# Altium schematic sheet 11_PHY_FE_17-24.SchDoc
size 419 x 296 mm; Author: Serbinov O.A.; CompanyName: ELSICOM; DrawnBy: Serbinov O.A.; Engineer: Serbinov O.A.; Organization: Elsicom; Address1: Kirova avenue, 58; Address2: Tomsk; Address3: Russia 634012; DocumentNumber: 12; SheetNumber: 12; SheetTotal: 44; ProjectName: 48_PORTS
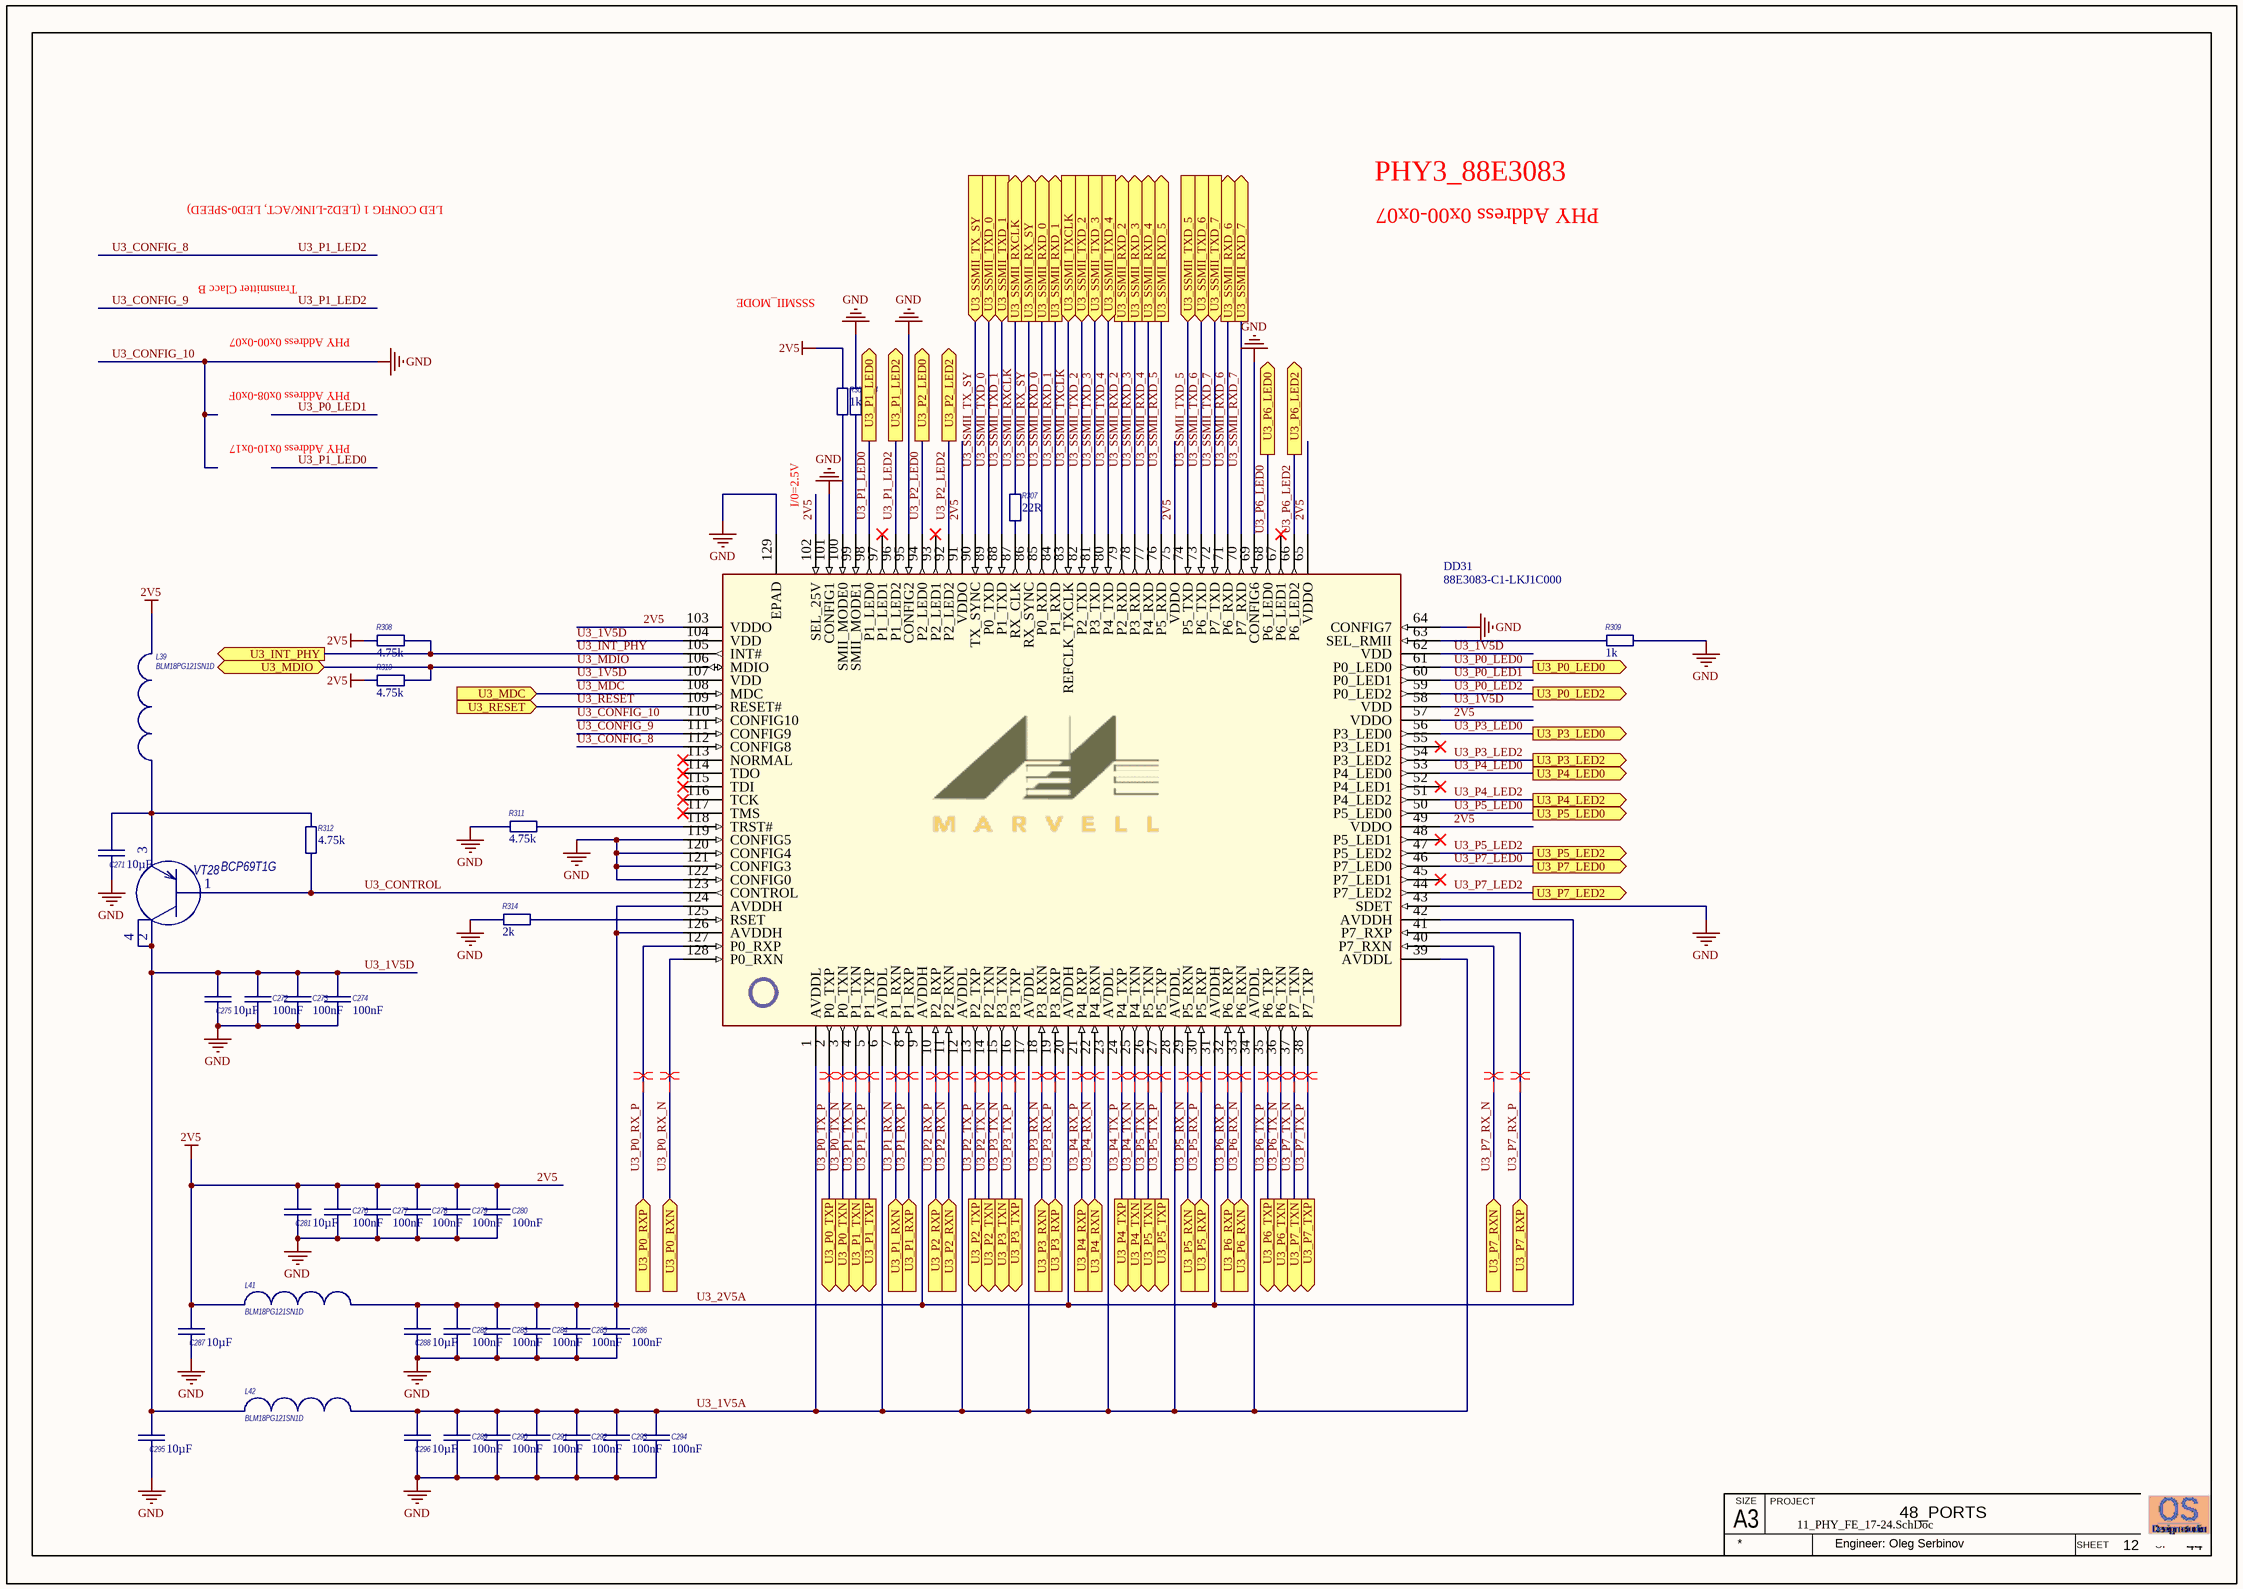
[diagram p0: 11_PHY_FE_17-24.SchDoc]

## Parts
C271  Capacitance: 10µF  [CAPC2012[0805]]  (hidden comment: GRM21BR61C106KE15)
C272  Capacitance: 100nF  [C0402_IPC High Density]  (hidden comment: GRM155R71E104KE14D)
C273  Capacitance: 100nF  [C0402_IPC High Density]  (hidden comment: GRM155R71E104KE14D)
C274  Capacitance: 100nF  [C0402_IPC High Density]  (hidden comment: GRM155R71E104KE14D)
C275  Capacitance: 10µF  [CAPC2012[0805]]  (hidden comment: GRM21BR61C106KE15)
C276  Capacitance: 100nF  [C0402_IPC High Density]  (hidden comment: GRM155R71E104KE14D)
C277  Capacitance: 100nF  [C0402_IPC High Density]  (hidden comment: GRM155R71E104KE14D)
C278  Capacitance: 100nF  [C0402_IPC High Density]  (hidden comment: GRM155R71E104KE14D)
C279  Capacitance: 100nF  [C0402_IPC High Density]  (hidden comment: GRM155R71E104KE14D)
C280  Capacitance: 100nF  [C0402_IPC High Density]  (hidden comment: GRM155R71E104KE14D)
C281  Capacitance: 10µF  [CAPC2012[0805]]  (hidden comment: GRM21BR61C106KE15)
C282  Capacitance: 100nF  [C0402_IPC High Density]  (hidden comment: GRM155R71E104KE14D)
C283  Capacitance: 100nF  [C0402_IPC High Density]  (hidden comment: GRM155R71E104KE14D)
C284  Capacitance: 100nF  [C0402_IPC High Density]  (hidden comment: GRM155R71E104KE14D)
C285  Capacitance: 100nF  [C0402_IPC High Density]  (hidden comment: GRM155R71E104KE14D)
C286  Capacitance: 100nF  [C0402_IPC High Density]  (hidden comment: GRM155R71E104KE14D)
C287  Capacitance: 10µF  [CAPC2012[0805]]  (hidden comment: GRM21BR61C106KE15)
C288  Capacitance: 10µF  [CAPC2012[0805]]  (hidden comment: GRM21BR61C106KE15)
C289  Capacitance: 100nF  [C0402_IPC High Density]  (hidden comment: GRM155R71E104KE14D)
C290  Capacitance: 100nF  [C0402_IPC High Density]  (hidden comment: GRM155R71E104KE14D)
C291  Capacitance: 100nF  [C0402_IPC High Density]  (hidden comment: GRM155R71E104KE14D)
C292  Capacitance: 100nF  [C0402_IPC High Density]  (hidden comment: GRM155R71E104KE14D)
C293  Capacitance: 100nF  [C0402_IPC High Density]  (hidden comment: GRM155R71E104KE14D)
C294  Capacitance: 100nF  [C0402_IPC High Density]  (hidden comment: GRM155R71E104KE14D)
C295  Capacitance: 10µF  [CAPC2012[0805]]  (hidden comment: GRM21BR61C106KE15)
C296  Capacitance: 10µF  [CAPC2012[0805]]  (hidden comment: GRM21BR61C106KE15)
DD31  88E3083-C1-LKJ1C000  [LQFP-128N]
L39  BLM18PG121SN1D  [INDC1608X95N]
L41  BLM18PG121SN1D  [INDC1608X95N]
L42  BLM18PG121SN1D  [INDC1608X95N]
R303  Resistance: 1k  [R0402_IPC High Density]  (hidden comment: ERJ-2RKF1001X)
R304  Resistance: 1k  [R0402_IPC High Density]  (hidden comment: ERJ-2RKF1001X)
R307  Resistance: 22R  [R0402_IPC High Density]  (hidden comment: ERJ-2RKF22R0X)
R308  Resistance (Ohms): 4.75k  [R0402_IPC High Density]  (hidden comment: ERJ-2RKF4751X)
R309  Resistance: 1k  [R0402_IPC High Density]  (hidden comment: ERJ-2RKF1001X)
R310  Resistance (Ohms): 4.75k  [R0402_IPC High Density]  (hidden comment: ERJ-2RKF4751X)
R311  Resistance (Ohms): 4.75k  [R0402_IPC High Density]  (hidden comment: ERJ-2RKF4751X)
R312  Resistance (Ohms): 4.75k  [R0402_IPC High Density]  (hidden comment: ERJ-2RKF4751X)
R314  Resistance (Ohms): 2k  [R0402_IPC High Density]  (hidden comment: ERJ-2RKF2001X)
VT28  BCP69T1G  [SOT223_N]

## Ports
U3_INT_PHY (out), U3_MDC (in), U3_MDIO (bidir), U3_P0_LED0 (out), U3_P0_LED2 (out), U3_P0_RXN (in), U3_P0_RXP (in), U3_P0_TXN (out), U3_P0_TXP (out), U3_P1_LED0 (out), U3_P1_LED2 (out), U3_P1_RXN (in), U3_P1_RXP (in), U3_P1_TXN (out), U3_P1_TXP (out), U3_P2_LED0 (out), U3_P2_LED2 (out), U3_P2_RXN (in), U3_P2_RXP (in), U3_P2_TXN (out), U3_P2_TXP (out), U3_P3_LED0 (out), U3_P3_LED2 (out), U3_P3_RXN (in), U3_P3_RXP (in), U3_P3_TXN (out), U3_P3_TXP (out), U3_P4_LED0 (out), U3_P4_LED2 (out), U3_P4_RXN (in), U3_P4_RXP (in), U3_P4_TXN (out), U3_P4_TXP (out), U3_P5_LED0 (out), U3_P5_LED2 (out), U3_P5_RXN (in), U3_P5_RXP (in), U3_P5_TXN (out), U3_P5_TXP (out), U3_P6_LED0 (out), U3_P6_LED2 (out), U3_P6_RXN (in), U3_P6_RXP (in), U3_P6_TXN (out), U3_P6_TXP (out), U3_P7_LED0 (out), U3_P7_LED2 (out), U3_P7_RXN (in), U3_P7_RXP (in), U3_P7_TXN (out), U3_P7_TXP (out), U3_RESET (in), U3_SSMII_RX_SY (out), U3_SSMII_RXCLK (out), U3_SSMII_RXD_0 (out), U3_SSMII_RXD_1 (out), U3_SSMII_RXD_2 (out), U3_SSMII_RXD_3 (out), U3_SSMII_RXD_4 (out), U3_SSMII_RXD_5 (out), U3_SSMII_RXD_6 (out), U3_SSMII_RXD_7 (out), U3_SSMII_TX_SY (in), U3_SSMII_TXCLK (in), U3_SSMII_TXD_0 (in), U3_SSMII_TXD_1 (in), U3_SSMII_TXD_2 (in), U3_SSMII_TXD_3 (in), U3_SSMII_TXD_4 (in), U3_SSMII_TXD_5 (in), U3_SSMII_TXD_6 (in), U3_SSMII_TXD_7 (in)

## Nets
2V5: C276.2 C277.2 C278.2 C279.2 C280.2 C281.2 C287.2 DD31.49(VDDO) DD31.57(VDDO) DD31.65(VDDO) DD31.75(VDDO) DD31.91(VDDO) DD31.102(SEL_25V) DD31.103(VDDO) L39.2 L41.1 R303.2 R308.1 R310.1
U3_CONFIG_10: C271.1 C272.1 C273.1 C274.1 C275.1 C276.1 C277.1 C278.1 C279.1 C280.1 C281.1 C282.1 C283.1 C284.1 C285.1 C286.1 C287.1 C288.1 C289.1 C290.1 C291.1 C292.1 C293.1 C294.1 C295.1 C296.1 DD31.43(SDET) DD31.64(CONFIG7) DD31.69(CONFIG6) DD31.95(CONFIG2) DD31.101(CONFIG1) DD31.110(CONFIG10) DD31.119(CONFIG5) DD31.120(CONFIG4) DD31.121(CONFIG3) DD31.122(CONFIG0) DD31.129(EPAD) R304.2 R309.1 R311.1 R314.1  [also labelled GND]
U3_1V5A: C289.2 C290.2 C291.2 C292.2 C293.2 C294.2 C296.2 DD31.1(AVDDL) DD31.6(AVDDL) DD31.12(AVDDL) DD31.17(AVDDL) DD31.23(AVDDL) DD31.28(AVDDL) DD31.34(AVDDL) DD31.39(AVDDL) L42.2
U3_1V5D: C272.2 C273.2 C274.2 C275.2 C295.2 DD31.58(VDD) DD31.62(VDD) DD31.104(VDD) DD31.107(VDD) L42.1 VT28.2(K) VT28.4(K)
U3_2V5A: C282.2 C283.2 C284.2 C285.2 C286.2 C288.2 DD31.9(AVDDH) DD31.20(AVDDH) DD31.31(AVDDH) DD31.42(AVDDH) DD31.124(AVDDH) DD31.126(AVDDH) L41.2
U3_CONFIG_8: DD31.96(P1_LED2) DD31.111(CONFIG9) DD31.112(CONFIG8) ; port U3_P1_LED2  [also labelled U3_CONFIG_9, U3_P1_LED2]
U3_CONTROL: DD31.123(CONTROL) R312.1 VT28.1(B)
U3_INT_PHY: DD31.105(INT#) R308.2 ; port U3_INT_PHY
U3_MDC: DD31.108(MDC) ; port U3_MDC
U3_MDIO: DD31.106(MDIO) R310.2 ; port U3_MDIO
U3_P0_LED0: DD31.61(P0_LED0) ; port U3_P0_LED0
U3_P0_LED1: DD31.60(P0_LED1)
U3_P0_LED2: DD31.59(P0_LED2) ; port U3_P0_LED2
U3_P0_RX_N: DD31.128(P0_RXN) ; port U3_P0_RXN
U3_P0_RX_P: DD31.127(P0_RXP) ; port U3_P0_RXP
U3_P0_TX_N: DD31.3(P0_TXN) ; port U3_P0_TXN
U3_P0_TX_P: DD31.2(P0_TXP) ; port U3_P0_TXP
U3_P1_LED0: DD31.98(P1_LED0) ; port U3_P1_LED0
U3_P1_RX_N: DD31.7(P1_RXN) ; port U3_P1_RXN
U3_P1_RX_P: DD31.8(P1_RXP) ; port U3_P1_RXP
U3_P1_TX_N: DD31.4(P1_TXN) ; port U3_P1_TXN
U3_P1_TX_P: DD31.5(P1_TXP) ; port U3_P1_TXP
U3_P2_LED0: DD31.94(P2_LED0) ; port U3_P2_LED0
U3_P2_LED2: DD31.92(P2_LED2) ; port U3_P2_LED2
U3_P2_RX_N: DD31.11(P2_RXN) ; port U3_P2_RXN
U3_P2_RX_P: DD31.10(P2_RXP) ; port U3_P2_RXP
U3_P2_TX_N: DD31.14(P2_TXN) ; port U3_P2_TXN
U3_P2_TX_P: DD31.13(P2_TXP) ; port U3_P2_TXP
U3_P3_LED0: DD31.56(P3_LED0) ; port U3_P3_LED0
U3_P3_LED2: DD31.54(P3_LED2) ; port U3_P3_LED2
U3_P3_RX_N: DD31.18(P3_RXN) ; port U3_P3_RXN
U3_P3_RX_P: DD31.19(P3_RXP) ; port U3_P3_RXP
U3_P3_TX_N: DD31.15(P3_TXN) ; port U3_P3_TXN
U3_P3_TX_P: DD31.16(P3_TXP) ; port U3_P3_TXP
U3_P4_LED0: DD31.53(P4_LED0) ; port U3_P4_LED0
U3_P4_LED2: DD31.51(P4_LED2) ; port U3_P4_LED2
U3_P4_RX_N: DD31.22(P4_RXN) ; port U3_P4_RXN
U3_P4_RX_P: DD31.21(P4_RXP) ; port U3_P4_RXP
U3_P4_TX_N: DD31.25(P4_TXN) ; port U3_P4_TXN
U3_P4_TX_P: DD31.24(P4_TXP) ; port U3_P4_TXP
U3_P5_LED0: DD31.50(P5_LED0) ; port U3_P5_LED0
U3_P5_LED2: DD31.47(P5_LED2) ; port U3_P5_LED2
U3_P5_RX_N: DD31.29(P5_RXN) ; port U3_P5_RXN
U3_P5_RX_P: DD31.30(P5_RXP) ; port U3_P5_RXP
U3_P5_TX_N: DD31.26(P5_TXN) ; port U3_P5_TXN
U3_P5_TX_P: DD31.27(P5_TXP) ; port U3_P5_TXP
U3_P6_LED0: DD31.68(P6_LED0) ; port U3_P6_LED0
U3_P6_LED2: DD31.66(P6_LED2) ; port U3_P6_LED2
U3_P6_RX_N: DD31.33(P6_RXN) ; port U3_P6_RXN
U3_P6_RX_P: DD31.32(P6_RXP) ; port U3_P6_RXP
U3_P6_TX_N: DD31.36(P6_TXN) ; port U3_P6_TXN
U3_P6_TX_P: DD31.35(P6_TXP) ; port U3_P6_TXP
U3_P7_LED0: DD31.46(P7_LED0) ; port U3_P7_LED0
U3_P7_LED2: DD31.44(P7_LED2) ; port U3_P7_LED2
U3_P7_RX_N: DD31.40(P7_RXN) ; port U3_P7_RXN
U3_P7_RX_P: DD31.41(P7_RXP) ; port U3_P7_RXP
U3_P7_TX_N: DD31.37(P7_TXN) ; port U3_P7_TXN
U3_P7_TX_P: DD31.38(P7_TXP) ; port U3_P7_TXP
U3_RESET: DD31.109(RESET#) ; port U3_RESET
U3_SSMII_RX_SY: DD31.86(RX_SYNC) ; port U3_SSMII_RX_SY
U3_SSMII_RXCLK: R307.2 ; port U3_SSMII_RXCLK
U3_SSMII_RXD_0: DD31.85(P0_RXD) ; port U3_SSMII_RXD_0
U3_SSMII_RXD_1: DD31.84(P1_RXD) ; port U3_SSMII_RXD_1
U3_SSMII_RXD_2: DD31.79(P2_RXD) ; port U3_SSMII_RXD_2
U3_SSMII_RXD_3: DD31.78(P3_RXD) ; port U3_SSMII_RXD_3
U3_SSMII_RXD_4: DD31.77(P4_RXD) ; port U3_SSMII_RXD_4
U3_SSMII_RXD_5: DD31.76(P5_RXD) ; port U3_SSMII_RXD_5
U3_SSMII_RXD_6: DD31.71(P6_RXD) ; port U3_SSMII_RXD_6
U3_SSMII_RXD_7: DD31.70(P7_RXD) ; port U3_SSMII_RXD_7
U3_SSMII_TX_SY: DD31.90(TX_SYNC) ; port U3_SSMII_TX_SY
U3_SSMII_TXCLK: DD31.83(REFCLK_TXCLK) ; port U3_SSMII_TXCLK
U3_SSMII_TXD_0: DD31.89(P0_TXD) ; port U3_SSMII_TXD_0
U3_SSMII_TXD_1: DD31.88(P1_TXD) ; port U3_SSMII_TXD_1
U3_SSMII_TXD_2: DD31.82(P2_TXD) ; port U3_SSMII_TXD_2
U3_SSMII_TXD_3: DD31.81(P3_TXD) ; port U3_SSMII_TXD_3
U3_SSMII_TXD_4: DD31.80(P4_TXD) ; port U3_SSMII_TXD_4
U3_SSMII_TXD_5: DD31.74(P5_TXD) ; port U3_SSMII_TXD_5
U3_SSMII_TXD_6: DD31.73(P6_TXD) ; port U3_SSMII_TXD_6
U3_SSMII_TXD_7: DD31.72(P7_TXD) ; port U3_SSMII_TXD_7
NetC271_2: C271.2 L39.1 R312.2 VT28.3(E)
NetDD31_63: DD31.63(SEL_RMII) R309.2
NetDD31_87: DD31.87(RX_CLK) R307.1
NetDD31_99: DD31.99(SMII_MODE1) R304.1
NetDD31_100: DD31.100(SMII_MODE0) R303.1
NetDD31_118: DD31.118(TRST#) R311.2
NetDD31_125: DD31.125(RSET) R314.2

Not connected (* = marked no-connect by the designer): DD31 45(P7_LED1)* 48(P5_LED1)* 52(P4_LED1)* 55(P3_LED1)* 67(P6_LED1)* 93(P2_LED1)* 97(P1_LED1)* 113(NORMAL)* 114(TDO)* 115(TDI)* 116(TCK)* 117(TMS)*

## Layout directives
differential pair: U3_P0_RX_N, U3_P0_RX_P, U3_P0_TX_N, U3_P0_TX_P, U3_P1_RX_N, U3_P1_RX_P, U3_P1_TX_N, U3_P1_TX_P, U3_P2_RX_N, U3_P2_RX_P, U3_P2_TX_N, U3_P2_TX_P, U3_P3_RX_N, U3_P3_RX_P, U3_P3_TX_N, U3_P3_TX_P, U3_P4_RX_N, U3_P4_RX_P, U3_P4_TX_N, U3_P4_TX_P, U3_P5_RX_N, U3_P5_RX_P, U3_P5_TX_N, U3_P5_TX_P, U3_P6_RX_N, U3_P6_RX_P, U3_P6_TX_N, U3_P6_TX_P, U3_P7_RX_N, U3_P7_RX_P, U3_P7_TX_N, U3_P7_TX_P

## Notes on the sheet
- PHY3_88E3083
- LED CONFIG 1 (LED2-LINK/ACT, LED0-SPEED)
- PHY Address 0x00-0x07
- Transmitter Clacc B
- SSSMII_MODE
- PHY Address 0x08-0x0F
- PHY Address 0x10-0x17
- I/0=2.5V
- A3
- SIZE
- PROJECT
- SHEET
- OF
- Engineer: Oleg Serbinov

## Library data of the parts
C271 C275 C281 C287 C288 C295 C296 = GRM21BR61C106KE15: C0805, 10uF 10%, 16V, X5R; Manufacturer: Murata; Customer Part Number: Конденсатор, 10u, 0805, 16V, X5R, 10%; Analogs: any suitable; Applications: General Purpose; Category: Capacitors; Operating Temperature: -55°C ~ 85°C; Package / Case: 0805 (2012 Metric); Size / Dimension: 0.079" L x 0.049" W (2.00mm x 1.25mm); Temperature Coefficient: X5R; Tolerance: ±10%; ComponentLink1URL: http://search.murata.co.jp/Ceramy/image/img/PDF/ENG/GRM21BR61C106KE15.pdf; ComponentLink1Description: http://search.murata.co.jp/Ceramy/image/img/PDF/ENG/GRM21BR61C106KE15.pdf; Pricing: 1=0.3, 10=0.25, 50=0.1408, 100=0.1252, 250=0.09392, 500=0.08294, 1000=0.07356 (USD); Voltage - Rated: 16V; Manufacturer Part Number: GRM21BR61C106KE15
C272-C274 C276-C280 C282-C286 C289-C294 = GRM155R71E104KE14D: C0402, 100nF, 25V, X7R; Manufacturer: Murata; Rmanufacturer: Yageo  Samsung  TDK  Taiyo Yuden  Kemet; Customer Part Number: Конденсатор, 100n, 0402, 25V, X7R, 10%; Capacitance Tolerance: ± 10%; Voltage Rating: 16; Capacitor Case Style: 0402 [1005 Metric]; Capacitor Terminals: SMD; SVHC: No SVHC (19-Dec-2012); No. of Pins: 2; Reel Quantity: 10000; Tolerance +: 10%; Analogs: any suitable; Supplier 1: Farnell; Supplier Part Number 1: 1118151; Manufacturer Part Number: GRM155R71E104KE14D; RoHS: YES; Stock: 3; Pricing: 10000=0.008593, 30000=0.007991 (GBP); Dielectric Characteristic: X7R; Operating Temperature Min: -55; Operating Temperature Max: 125; Operating Temperature Range: -55°C to +125; Package / Case: 0402; Packaging: Reel; Series: GRM Hi-Cap; Terminal Type: Surface Mount (SMD, SMT); Tolerance -: 10%; Voltage Rating V DC: 16; ComponentLink1URL: http://www.farnell.com/datasheets/4360.pdf; ComponentLink1Description: http://www.farnell.com/datasheets/4360.pdf
DD31 = 88E3083-C1-LKJ1C000: IC 10/100BASE-T OCTAL PHY; Customer Part Number: Микросхема, 88E3083-C1-LKJ1C000, IC 10/100BASE-T OCTAL PHY, 128 LQFP; Manufacturer: Marvell Technology Group; Manufacturer Part Number: 88E3083-C1-LKJ1C000
L39 L41 L42 = BLM18PG121SN1D: FILTER BLM18 (0603, 2A); Manufacturer: Murata; Rpart number: MPZ1608S121ATAH0 ; CIC10P121NC ; MPZ1608S121ATDH5 ; BLM18PG121SH1D ; 742792625; Rmanufacturer: Boruns  Samsung  TDK  Murata  Wurth Electronics; Customer Part Number: Дроссель, BLM18PG121SN1D, FERRITE BEAD 120 OHM 1LN, 0603; DC Resistance Max: 0.05; Impedance: 120; Ferrite Mounting: SMD; Inductor Type: Ferrite Bead; SVHC: No SVHC (19-Dec-2011); Ferrite Case Style: 0603 / 1608; Core Material: Ferrite; DC Current Max: 2000; Inductor Case Style: 0603; Inductance Tolerance: ± 25%; No. of Pins: 2; RoHS: YES; Operating Temperature Min: -55; Mounting Type: SMD; Operating Temperature Max: +125; Package / Case: 0603; Impedance @ 100MHz Typ: 120; Resistance: 0.05; Supplier Part Number: 1515738; Supplier: Farnell; ComponentLink1URL: http://www.farnell.com/datasheets/5148.pdf; ComponentLink1Description: http://www.farnell.com/datasheets/5148.pdf; Pricing: 5=0.056, 50=0.041, 100=0.034, 250=0.028, 500=0.027 (GBP); Manufacturer Part Number: BLM18PG121SN1D; DC Current Rating: 2A; Analogs: MPZ1608S121ATAH0 ; CIC10P121NC ; MPZ1608S121ATDH5 ; BLM18PG121SH1D ; 742792625
R303 R304 R309 = ERJ-2RKF1001X: R0402, 1k 1%; Manufacturer: Panasonic; Rpart number: RC0402FR-071KL ; RC1005F102CS ; RMCF0402FT1K00 ; MCR01MRTF1001 ; CRCW04021K00FKED ; ERJ2RKF1001X; Rmanufacturer: Yageo  Samsung  Stackpole Electronics  Rohm Semiconductor  Vishay Dale; Customer Part Number: Резистор, 1K, 0402, 1%; Temperature Coefficient: 100 PPM / C; Power Rating: 100 mWatts; Voltage Rating: 50 Volts; Analogs: any suitable; Supplier: Mouser; Termination Style: SMD/SMT; Series: ERJ; Supplier Part Number: 667-ERJ-2RKF1001X; RoHS: RoHS Compliant By Exemption; Dimensions: 0.5 mm W x 1 mm L x 0.35 mm H; Package / Case: 0402 (1005 metric); Product Category: .; Manufacturer Part Number: ERJ-2RKF1001X; Packaging: Reel; Tolerance: 1 %; Operating Temperature Range: - 55 C to + 155 C; Category: Thick Film Resistors - SMD; Product: Thick Film Resistors SMD; Reeling: True; Minimum Order Quantity: 1; RoHS - Mouser: E; Standard Pack Qty: 10000; ComponentLink1URL: http://industrial.panasonic.com/www-data/pdf/AOA0000/AOA0000CE2.pdf; ComponentLink1Description: http://industrial.panasonic.com/www-data/pdf/AOA0000/AOA0000CE2.pdf; Pricing: 1=0.135, 25=0.032, 100=0.024, 250=0.018, 500=0.014, 1000=0.008, 2000=0.007, 5000=0.004 (AUD)
R307 = ERJ-2RKF22R0X: R0402, 22R 1%; Manufacturer: Panasonic; Rpart number: RC0402FR-0749R9L ; RC1005F49R9CS ; MCR01MRTF49R9 ; CRCW040249R9FKED ; CR0402-FX-49R9GLF ; RC-02W220FT; Rmanufacturer: Yageo  Samsung  Stackpole Electronics  Rohm Semiconductor  Vishay Dale; Customer Part Number: Резистор, 22R, 0402, 1%; Power Rating: 100; Voltage Rating: 50; Temperature Coefficient: ± 100; Resistor Element Material: Thick Film; Resistor Case Style: 0402; Resistor Mounting: SMD; Analogs: any suitable; Supplier 1: Farnell; Supplier Part Number 1: 2059106; RoHS 1: YES; Stock 1: 10948; Pricing 1: 50=0.016, 100=0.012, 500=0.006, 1000=0.004 (GBP); Resistance Tolerance: ± 1%; ComponentLink1URL: http://www.farnell.com/datasheets/426256.pdf; ComponentLink1Description: http://www.farnell.com/datasheets/426256.pdf; Supplier: Farnell; RoHS: YES; Manufacturer Part Number: ERJ-2RKF22R0X; Supplier Part Number: 2059106; Pricing: 50=0.016, 100=0.012, 500=0.006, 1000=0.004 (GBP)
R308 R310-R312 = ERJ-2RKF4751X: R0402, 4.75k 1%; Manufacturer: Panasonic; Rpart number: RC0402FR-074K75L ; RC1005F4751CS ; RMCF0402FT4K75 ; CRCW04024K75FKED ; TRR01MZPF4751; Rmanufacturer: Yageo  Samsung  Stackpole Electronics  Rohm Semiconductor  Vishay Dale; Customer Part Number: Резистор, 4K75, 0402, 1%; Temperature Coefficient: ±100ppm/°C; Power (Watts): 0.1W, 1/10W; Analogs: any suitable; Tolerance: ±1%; Packaging: Cut Tape (CT); Package / Case: 0402 (1005 Metric); Category: Resistors; Manufacturer Part Number: ERJ-2RKF4751X; Supplier Part Number: P4.75KLCT-ND; RoHS: RoHS Compliant; Supplier: Digi-Key; ComponentLink1URL: http://industrial.panasonic.com/www-cgi/jvcr13pz.cgi?E+PZ+3+AOA0002+ERJ2RKF4751X+7+WW; ComponentLink1Description: http://industrial.panasonic.com/www-cgi/jvcr13pz.cgi?E+PZ+3+AOA0002+ERJ2RKF4751X+7+WW; Features: -; Composition: Thick Film; Height: 0.016" (0.40mm); Number of Terminations: 2; Supplier Device Package: 0402; Size / Dimension: 0.039" L x 0.020" W (1.00mm x 0.50mm)
R314 = ERJ-2RKF2001X: R0402, 2k 1%; Manufacturer: Panasonic; Customer Part Number: Резистор, 2K, 0402, 1%; Temperature Coefficient: ±100ppm/°C; Power (Watts): 0.1W, 1/10W; Analogs: any suitable; Tolerance: ±1%; Package / Case: 0402 (1005 Metric); Features: -; Height: 0.016" (0.40mm); Size / Dimension: 0.039" L x 0.020" W (1.00mm x 0.50mm); Category: Resistors; Supplier: Digi-Key; Composition: Thick Film; RoHS: RoHS Compliant; Supplier Part Number: P2.00KLTR-ND; Manufacturer Part Number: ERJ-2RKF2001X; Packaging: Tape & Reel (TR); Number of Terminations: 2; ComponentLink1URL: http://industrial.panasonic.com/www-cgi/jvcr13pz.cgi?E+PZ+3+AOA0002+ERJ2RKF2001X+7+WW; ComponentLink1Description: http://industrial.panasonic.com/www-cgi/jvcr13pz.cgi?E+PZ+3+AOA0002+ERJ2RKF2001X+7+WW; Pricing: 10000=0.00347, 30000=0.00305, 50000=0.00279, 100000=0.00274 (USD)
VT28 = BCP69T1: TRANSISTOR PNP -20V -1A SOT-223; Manufacturer: ON Semiconductor; Rpart number: FZT549TA; Rmanufacturer: Diodes Incorporated; Customer Part Number: Транзистор, BCP69T1G, TRANS PNP 20V 1A, SOT-223; Description 1: Transistors Bipolar - BJT 1A 20V PNP; Category 1: Transistors Bipolar - BJT; Collector- Emitter Voltage VCEO Max: 20 V; Configuration: Single; Emitter- Base Voltage VEBO: 5 V; Power Dissipation: 1.5 W; DC Collector/Base Gain hfe Min: 50 at 5 mA at 10 V; Maximum DC Collector Current: 1 A; Maximum Operating Frequency: 60 MHz; Product Status: Obsolete; Supplier 1: Mouser; Supplier Part Number 1: 863-BCP69T1; RoHS 1: RoHS Compliant; Stock 1: 0; Package / Case: SOT-223-4; Packaging: Reel; Continuous Collector Current: - 1 A; Mounting Style: SMD/SMT; Transistor Polarity: PNP; Maximum Operating Temperature: + 150 C; Minimum Operating Temperature: - 65 C; Product Category: Transistors Bipolar- General Purpose; Standard Pack Qty: 1000; RoHS - Mouser: N; Minimum Order Quantity: 1; Reeling: True; ComponentLink1URL: http://www.onsemi.com/pub/Collateral/BCP69T1-D.PDF; ComponentLink1Description: http://www.onsemi.com/pub/Collateral/BCP69T1-D.PDF; RoHS: RoHS Compliant; Supplier Part Number: 863-BCP69T1; Manufacturer Part Number: BCP69T1; Supplier: Mouser; Category: Transistors Bipolar - BJT; Analogs: FZT549TA